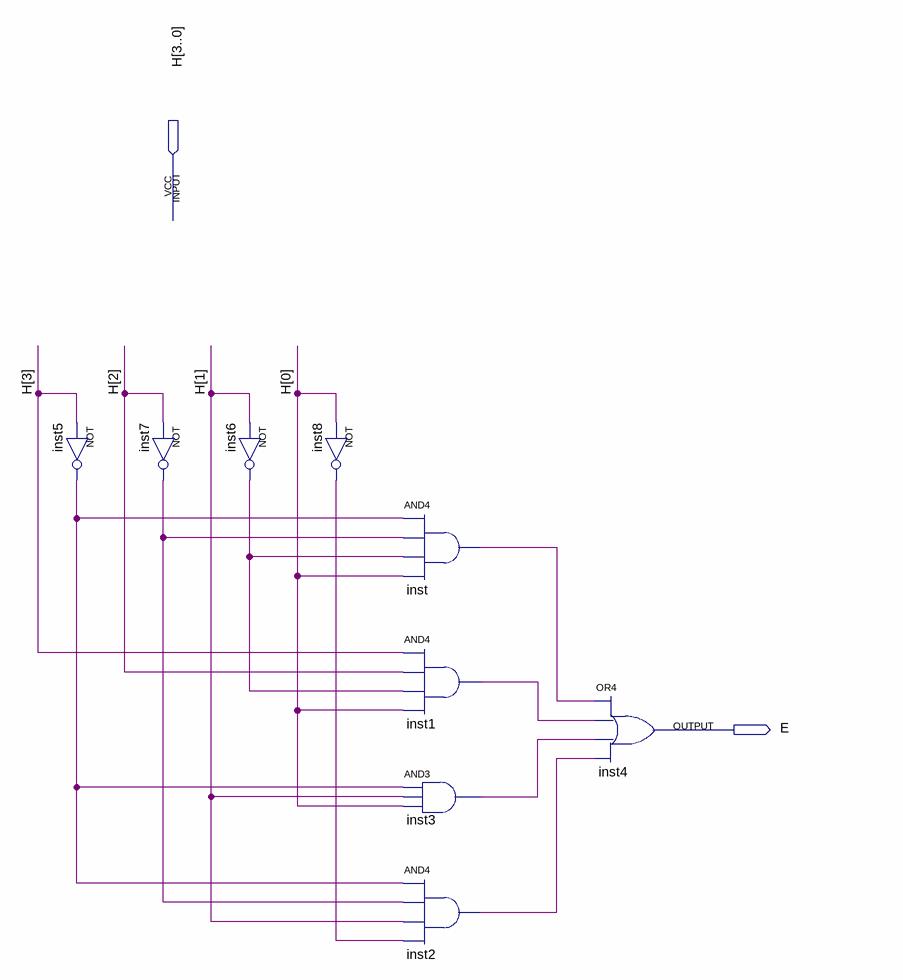
[diagram p0: schematic sheet]
// Quartus schematic F_Logic.bdf as structural Verilog: 9 symbols, 2 pins
module F_Logic (
  input  [3:0] H,
  output E
);

  wire inst1_out, inst2_out, inst3_out, inst5_out, inst6_out, inst7_out, inst8_out, inst_out;

  not inst5 (inst5_out, H[3]);
  not inst7 (inst7_out, H[2]);
  not inst6 (inst6_out, H[1]);
  not inst8 (inst8_out, H[0]);
  and inst (inst_out, inst5_out, inst7_out, inst6_out, H[0]);
  and inst1 (inst1_out, H[3], H[2], inst6_out, H[0]);
  and inst3 (inst3_out, inst5_out, H[1], H[0]);
  and inst2 (inst2_out, inst5_out, inst7_out, H[1], inst8_out);
  or inst4 (E, inst_out, inst1_out, inst3_out, inst2_out);
endmodule
